# EAGLE design FUSE (EAGLE 9.4.0)
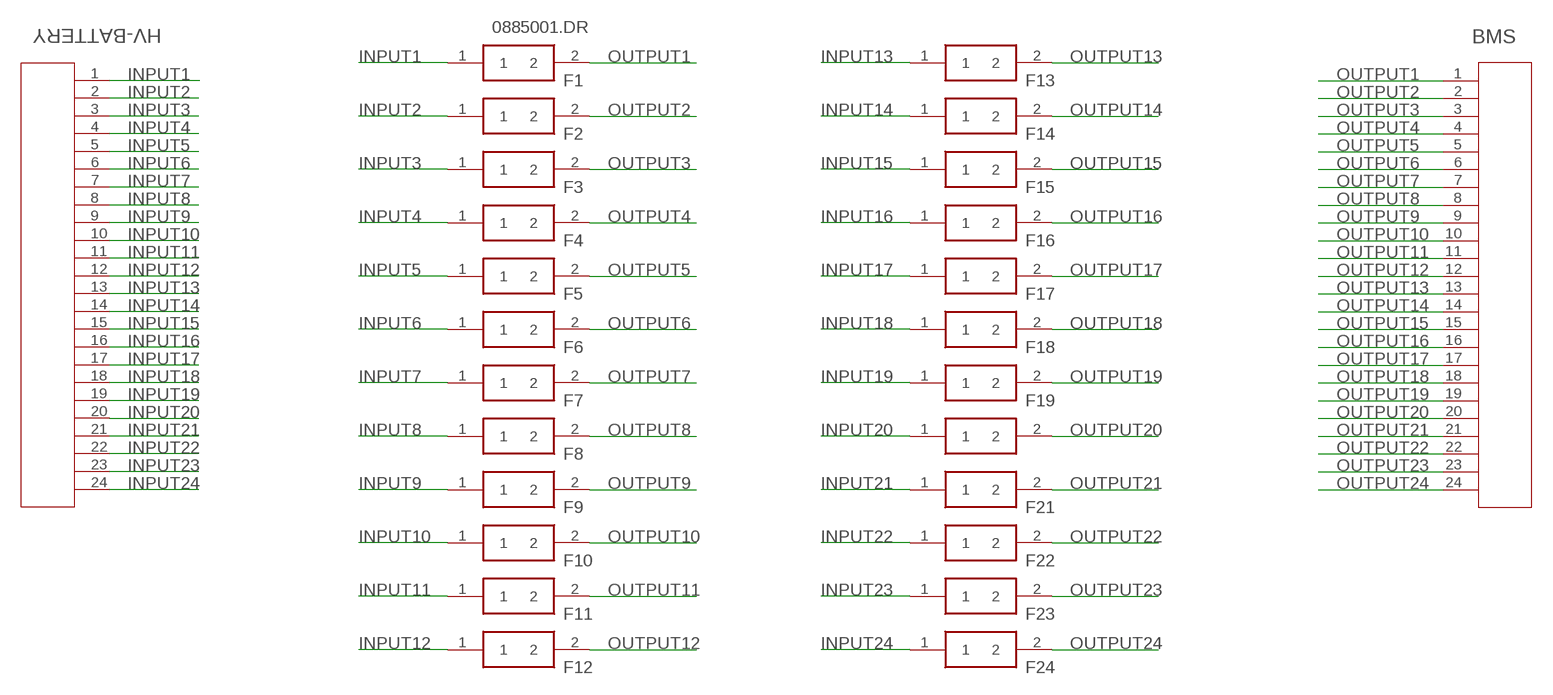
[diagram p0: schematic, sheet 1]

## Parts
BMS  24P(90DEG)_1-794108-0  [CON24_2X12_P4_14MM_RAMNL]
F1  0885001.DR  [FUSC10948X488N]
F2  0885001.DR  [FUSC10948X488N]
F3  0885001.DR  [FUSC10948X488N]
F4  0885001.DR  [FUSC10948X488N]
F5  0885001.DR  [FUSC10948X488N]
F6  0885001.DR  [FUSC10948X488N]
F7  0885001.DR  [FUSC10948X488N]
F8  0885001.DR  [FUSC10948X488N]
F9  0885001.DR  [FUSC10948X488N]
F10  0885001.DR  [FUSC10948X488N]
F11  0885001.DR  [FUSC10948X488N]
F12  0885001.DR  [FUSC10948X488N]
F13  0885001.DR  [FUSC10948X488N]
F14  0885001.DR  [FUSC10948X488N]
F15  0885001.DR  [FUSC10948X488N]
F16  0885001.DR  [FUSC10948X488N]
F17  0885001.DR  [FUSC10948X488N]
F18  0885001.DR  [FUSC10948X488N]
F19  0885001.DR  [FUSC10948X488N]
F20  0885001.DR  [FUSC10948X488N]
F21  0885001.DR  [FUSC10948X488N]
F22  0885001.DR  [FUSC10948X488N]
F23  0885001.DR  [FUSC10948X488N]
F24  0885001.DR  [FUSC10948X488N]
HV-BATTERY  24P(90DEG)_1-794108-0  [CON24_2X12_P4_14MM_RAMNL]

## Nets
INPUT1: F1.1 HV-BATTERY.1
INPUT2: F2.1 HV-BATTERY.2
INPUT3: F3.1 HV-BATTERY.3
INPUT4: F4.1 HV-BATTERY.4
INPUT5: F5.1 HV-BATTERY.5
INPUT6: F6.1 HV-BATTERY.6
INPUT7: F7.1 HV-BATTERY.7
INPUT8: F8.1 HV-BATTERY.8
INPUT9: F9.1 HV-BATTERY.9
INPUT10: F10.1 HV-BATTERY.10
INPUT11: F11.1 HV-BATTERY.11
INPUT12: F12.1 HV-BATTERY.12
INPUT13: F13.1 HV-BATTERY.13
INPUT14: F14.1 HV-BATTERY.14
INPUT15: F15.1 HV-BATTERY.15
INPUT16: F16.1 HV-BATTERY.16
INPUT17: F17.1 HV-BATTERY.17
INPUT18: F18.1 HV-BATTERY.18
INPUT19: F19.1 HV-BATTERY.19
INPUT20: F20.1 HV-BATTERY.20
INPUT21: F21.1 HV-BATTERY.21
INPUT22: F22.1 HV-BATTERY.22
INPUT23: F23.1 HV-BATTERY.23
INPUT24: F24.1 HV-BATTERY.24
OUTPUT1: BMS.1 F1.2
OUTPUT2: BMS.2 F2.2
OUTPUT3: BMS.3 F3.2
OUTPUT4: BMS.4 F4.2
OUTPUT5: BMS.5 F5.2
OUTPUT6: BMS.6 F6.2
OUTPUT7: BMS.7 F7.2
OUTPUT8: BMS.8 F8.2
OUTPUT9: BMS.9 F9.2
OUTPUT10: BMS.10 F10.2
OUTPUT11: BMS.11 F11.2
OUTPUT12: BMS.12 F12.2
OUTPUT13: BMS.13 F13.2
OUTPUT14: BMS.14 F14.2
OUTPUT15: BMS.15 F15.2
OUTPUT16: BMS.16 F16.2
OUTPUT17: BMS.17 F17.2
OUTPUT18: BMS.18 F18.2
OUTPUT19: BMS.19 F19.2
OUTPUT20: BMS.20 F20.2
OUTPUT21: BMS.21 F21.2
OUTPUT22: BMS.22 F22.2
OUTPUT23: BMS.23 F23.2
OUTPUT24: BMS.24 F24.2

## Library data of the parts
BMS HV-BATTERY = con-MATE-N-LOK:24P(90DEG)_1-794108-0; MANUFACTURER_PART_NUMBER: 17941080; VENDOR: TE Connectivity
F1-F24 = 0885001.DR:0885001.DR: LITTELFUSE - 0885001.DR - FUSE, AEC-Q200, 1A, 500VDC, 0402 Source: Datasheet <https://m.littelfuse.com/~/media/electronics/datasheets/fuses/littelfuse_fuse_885_datasheet.pdf.pdf>; DESCRIPTION: LITTELFUSE - 0885001.DR - FUSE, AEC-Q200, 1A, 500VDC, 0402; HEIGHT: 4.88mm; MANUFACTURER_NAME: LITTELFUSE; MANUFACTURER_PART_NUMBER: 0885001.DR; MOUSER_PART_NUMBER: 576-0885001.DR; MOUSER_PRICE-STOCK: https://www.mouser.com/Search/Refine.aspx?Keyword=576-0885001.DR

## Board
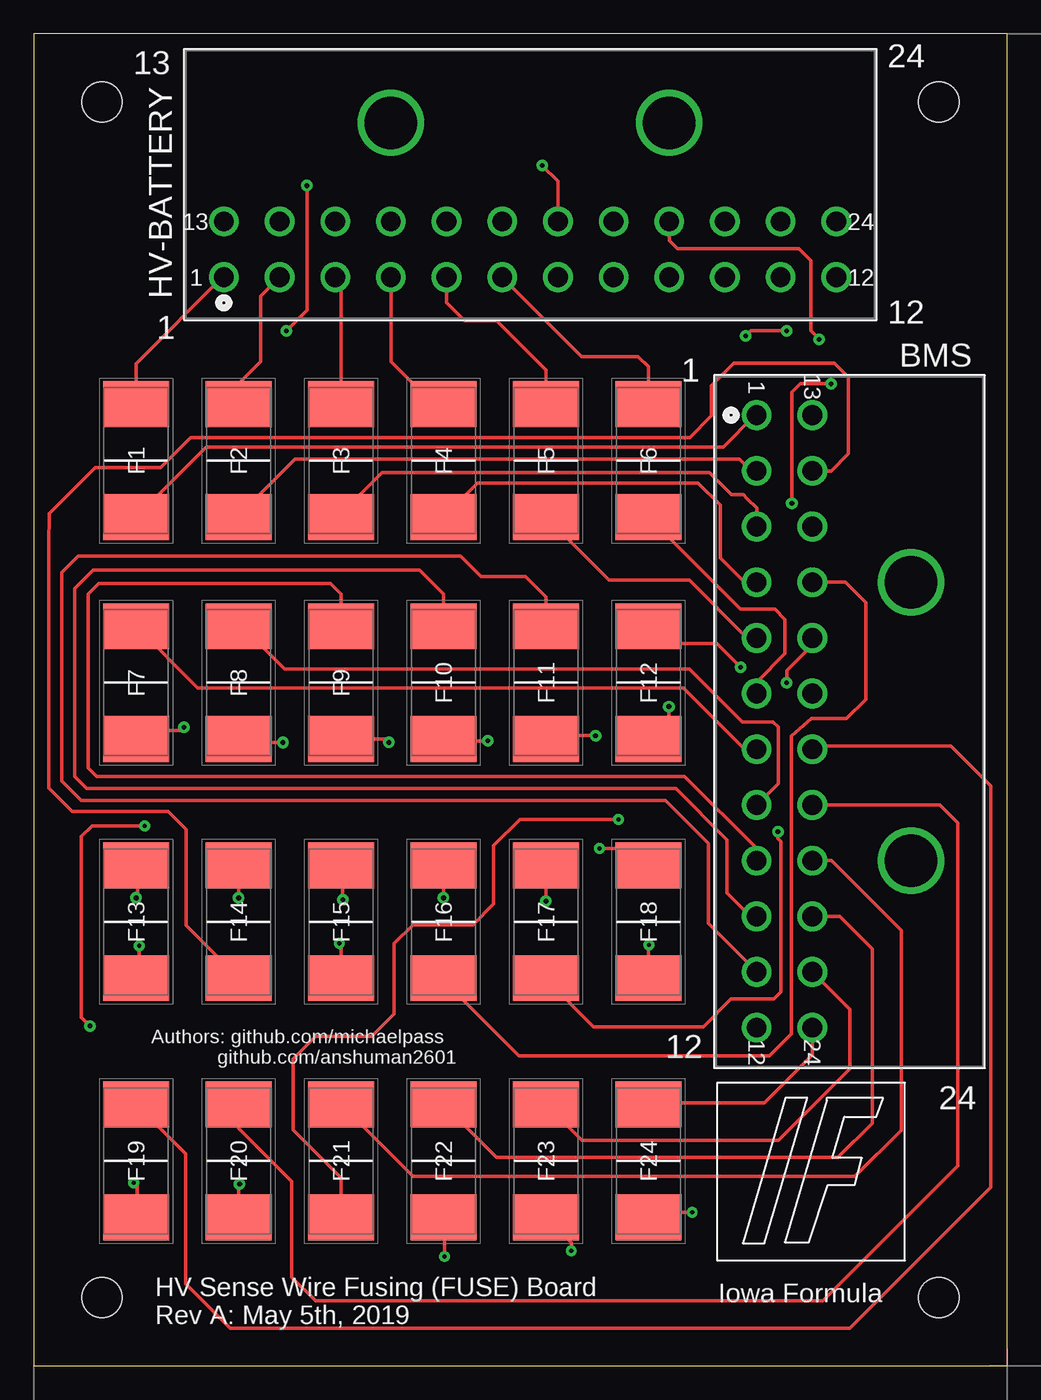
[diagram p1: board, top side]
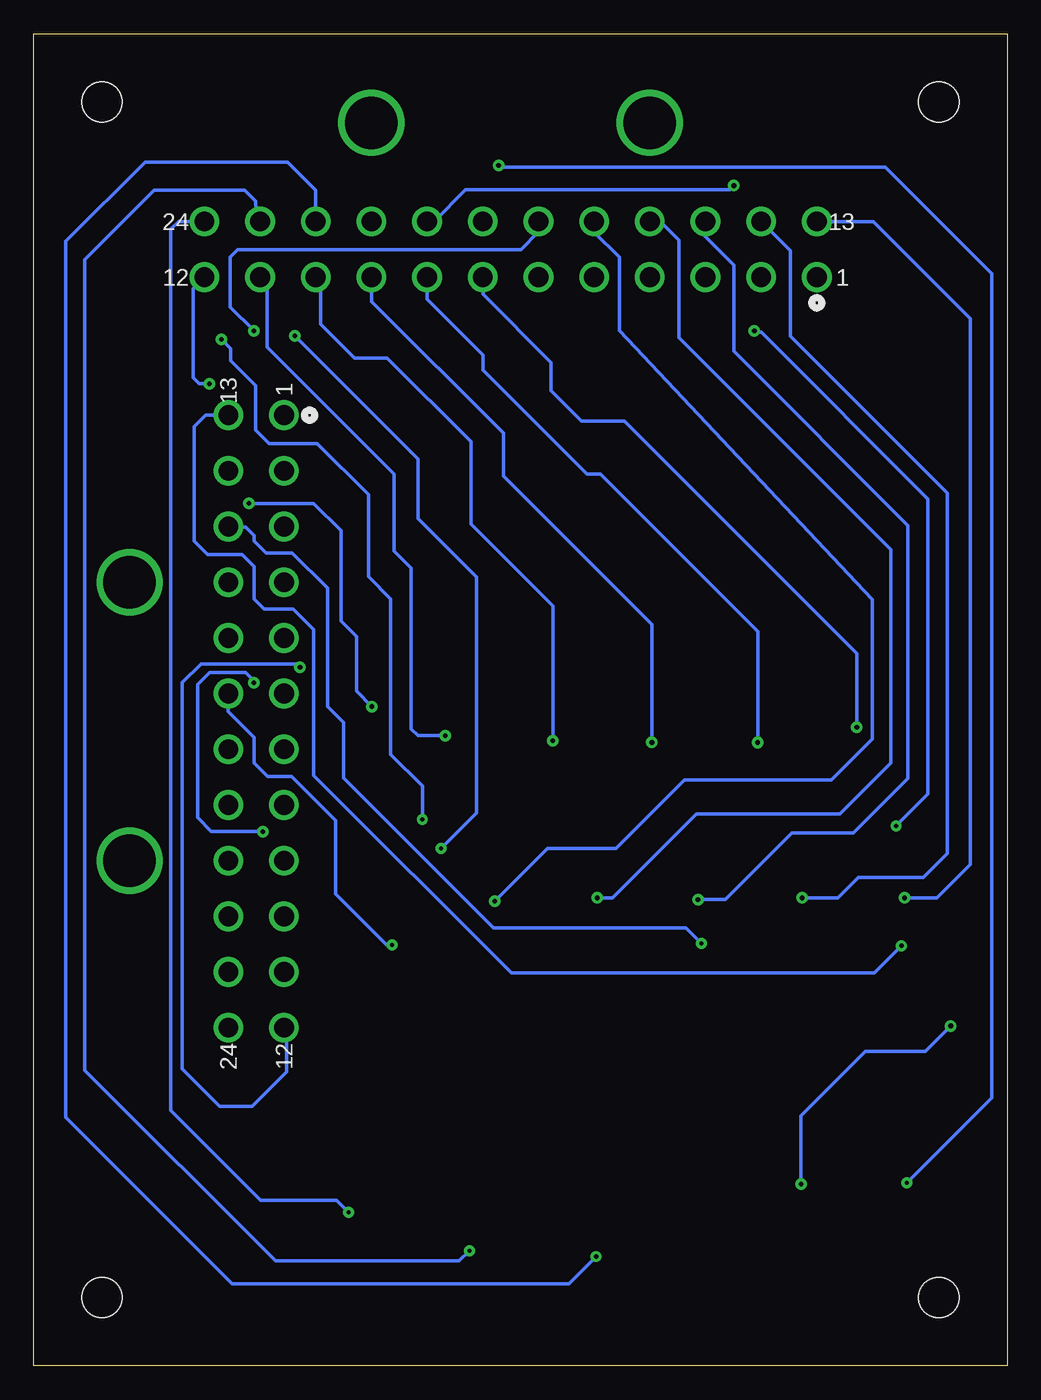
[diagram p2: board, bottom side, seen from below]

Size 72.39 x 99.06 mm. Coordinates in mm from the lower left corner, seen from the top.
Outline: 0,0 72.39,0 72.39,99.06 0,99.06 0,0
Copper layers (1*16): Top 0.035mm / dielectric 1.5mm / Bottom 0.035mm
Design rules "default *": minimum track width 8mil, minimum drill 12mil, track to track 8mil, track to pad 8mil, pad to pad 8mil, via to via 8mil, smd to smd 8mil, copper to edge 10mil, drill to drill 8mil, minimum pad ring 12mil, minimum via ring 10mil, stop-mask expansion 4mil, vias tented up to drill 35mil, thermal gap 10mil
Holes 3 mm at 5.08,5.08 67.31,5.08 67.31,93.98 5.08,93.98

### Footprints (pad centres in the part's own frame; a part is rotated, then mirrored left to right if it is on the bottom)
CON24_2X12_P4_14MM_RAMNL = drill 1.473 pad 1.981: 1 -45.542,-4.14; 2 -41.402,-4.14; 3 -37.262,-4.14; 4 -33.122,-4.14; 5 -28.981,-4.14; 6 -24.841,-4.14; 7 -20.701,-4.14; 8 -16.561,-4.14; 9 -12.421,-4.14; 10 -8.28,-4.14; 11 -4.14,-4.14; 12 0,-4.14; 13 -45.542,0; 14 -41.402,0; 15 -37.262,0; 16 -33.122,0; 17 -28.981,0; 18 -24.841,0; 19 -20.701,0; 20 -16.561,0; 21 -12.421,0; 22 -8.28,0; 23 -4.14,0; 24 0,0 | drill 3.912 pad 3.912: 25 -33.122,7.341; 26 -12.421,7.341
FUSC10948X488N = smd 3.41 x 4.91: 1 -4.195,0; 2 4.195,0

### Placement (x,y rotation side)
BMS  57.91,25.15 270 top
F1  7.62,67.31 270 top
F2  15.24,67.31 270 top
F3  22.86,67.31 270 top
F4  30.48,67.31 270 top
F5  38.1,67.31 270 top
F6  45.72,67.31 270 top
F7  7.62,50.8 90 top
F8  15.24,50.8 90 top
F9  22.86,50.8 90 top
F10  30.48,50.8 90 top
F11  38.1,50.8 90 top
F12  45.72,50.8 90 top
F13  7.62,33.02 270 top
F14  15.24,33.02 270 top
F15  22.86,33.02 270 top
F16  30.48,33.02 270 top
F17  38.1,33.02 270 top
F18  45.72,33.02 270 top
F19  7.62,15.24 90 top
F20  15.24,15.24 90 top
F21  22.86,15.24 90 top
F22  30.48,15.24 90 top
F23  38.1,15.24 90 top
F24  45.72,15.24 90 top
HV-BATTERY  59.69,85.09 0 top

### Tracks (layer width: path | path; a pad name or v marks a point on that pad's centre or on a via)
INPUT1
  Top 0.254: HV-BATTERY.1 14.15,81.05 7.62,74.52 F1.1
INPUT2
  Top 0.254: HV-BATTERY.2 16.89,79.55 16.89,74.68 15.24,73.03 F2.1
INPUT3
  Top 0.254: F3.1 22.86,80.43 22.38,80.9 HV-BATTERY.3
INPUT4
  Top 0.254: HV-BATTERY.4 26.57,74.66 29.72,71.5 F4.1
INPUT5
  Top 0.254: HV-BATTERY.5 30.71,79.05 32.03,77.72 34.42,77.72 38.1,74.05 F5.1
INPUT6
  Top 0.254: HV-BATTERY.6 40.74,75.06 44.96,75.06 45.72,74.3 F6.1
INPUT7  (via drill 0.35)
  Top 0.254: v11.18,47.49 10.92,47.24 8.26,47.24 F7.1
  Bottom 0.254: HV-BATTERY.7 38.99,79.68 33.91,74.6 33.91,72.5 31.64,70.23 28.45,70.23 11.18,52.95 v11.18,47.49
INPUT8  (via drill 0.35)
  Top 0.254: F8.1 14.99,46.35 v18.54,46.35
  Bottom 0.254: HV-BATTERY.8 43.13,79.3 38.99,75.16 38.99,74.04 31.25,66.29 30.23,66.29 18.54,54.61 v18.54,46.35
INPUT9  (via drill 0.35)
  Top 0.254: v26.42,46.35 26.17,46.6 F9.1
  Bottom 0.254: HV-BATTERY.9 47.27,79.15 37.47,69.34 37.47,66.17 26.42,55.12 v26.42,46.35
INPUT10  (via drill 0.35)
  Top 0.254: v33.78,46.48 30.6,46.48 F10.1
  Bottom 0.254: HV-BATTERY.10 51.05,80.59 51.05,77.47 48.51,74.93 46.1,74.93 39.88,68.71 39.88,66.21 39.88,66.04 39.88,62.61 33.78,56.52 v33.78,46.48
INPUT11  (via drill 0.35)
  Top 0.254: v41.78,46.86 38.36,46.86 F11.1
  Bottom 0.254: HV-BATTERY.11 55.04,80.44 55.04,75.74 45.59,66.29 45.59,60.58 44.32,59.31 44.32,47.37 43.81,46.86 v41.78,46.86
INPUT12  (via drill 0.35)
  Top 0.254: v47.24,49.02 47.24,48.13 F12.1 | v56.39,64.14 56.39,72.39 57.02,73.03 v59.31,73.03
  Bottom 0.254: HV-BATTERY.12 60.54,80.1 60.54,73.5 60.07,73.03 v59.31,73.03 | v47.24,49.02 48.39,50.16 48.39,54.23 49.53,55.37 49.53,62.1 51.56,64.14 v56.39,64.14
INPUT13  (via drill 0.35)
  Top 0.254: v7.62,34.8 7.75,34.93 7.75,37.09 F13.1
  Bottom 0.254: HV-BATTERY.13 9.96,85.09 2.74,77.88 2.74,37.27 5.21,34.8 v7.62,34.8
INPUT14  (via drill 0.35)
  Top 0.254: F14.1 v15.24,34.8
  Bottom 0.254: HV-BATTERY.14 16.13,82.93 16.13,76.58 4.45,64.9 4.45,38.1 6.22,36.32 11.05,36.32 12.57,34.8 v15.24,34.8
INPUT15  (via drill 0.35)
  Top 0.254: F15.1 22.99,37.09 v22.99,34.67
  Bottom 0.254: HV-BATTERY.15 22.43,83.95 20.32,81.84 20.32,75.44 7.37,62.48 7.37,43.69 11.43,39.62 16,39.62 20.95,34.67 v22.99,34.67
INPUT16  (via drill 0.35)
  Top 0.254: v30.48,34.8 F16.1
  Bottom 0.254: v30.48,34.8 29.34,34.8 23.11,41.02 12.45,41.02 8.64,44.83 8.64,60.71 24.38,76.45 24.38,83.69 25.78,85.09 HV-BATTERY.16
INPUT17  (via drill 0.35)
  Top 0.254: v38.1,34.54 F17.1
  Bottom 0.254: v38.1,34.54 34.16,38.48 29.08,38.48 24,43.56 13.08,43.56 10.03,46.61 10.03,56.98 28.83,76.96 28.83,82.42 30.71,84.3 HV-BATTERY.17
INPUT18  (via drill 0.3, 0.35)
  Top 0.254: F18.1 45.01,37.22 43.74,38.48 v42.09,38.48 | v56.01,76.96 53.34,76.96 v52.96,76.58
  Bottom 0.254: HV-BATTERY.18 34.85,84.32 36.16,83.01 57.2,83.01 57.78,82.42 57.78,78.74 v56.01,76.96 | v52.96,76.58 43.81,67.44 43.81,62.99 39.47,58.65 39.47,41.1 v42.09,38.48
INPUT19  (via drill 0.3, 0.35)
  Top 0.254: v7.44,13.61 7.7,13.36 7.7,11.12 F19.1 | HV-BATTERY.19 38.99,88.08 v37.81,89.26
  Bottom 0.254: v37.81,89.26 37.69,89.13 9.06,89.13 1.14,81.2 1.14,19.92 v7.44,13.61
INPUT20  (via drill 0.3, 0.35)
  Top 0.254: v8.26,40.16 4.34,40.16 3.56,39.37 3.56,25.91 v4.19,25.27 | v15.32,13.51 15.24,13.44 F20.1 | v20.32,87.76 20.32,78.49 v18.8,76.96
  Bottom 0.254: HV-BATTERY.20 42.62,85.09 40.26,87.45 20.62,87.45 v20.32,87.76 | v8.26,40.16 5.89,42.52 5.89,64.47 18.27,76.85 18.68,76.85 v18.8,76.96 | v15.32,13.51 15.32,18.59 10.54,23.37 6.1,23.37 v4.19,25.27
INPUT21  (via drill 0.3, 0.35)
  Top 0.254: v43.48,40.64 36.17,40.64 34.21,38.68 34.21,34.34 32.66,32.79 28.22,32.79 26.82,31.39 26.82,26.19 25.15,24.51 20.95,24.51 19.28,22.84 19.28,17.55 22.86,13.97 F21.1 | v58.42,76.33 57.78,76.96 57.78,82.17 56.9,83.06 47.88,83.06 47.27,83.67 HV-BATTERY.21
  Bottom 0.254: v43.48,40.64 43.48,43.1 45.85,45.47 45.85,57.02 47.5,58.67 47.5,64.77 51.31,68.58 54.86,68.58 55.88,69.6 55.88,72.9 57.73,74.75 57.73,75.64 v58.42,76.33
INPUT22  (via drill 0.3)
  Top 0.254: v30.56,8.13 30.56,10.97 F22.1
  Bottom 0.254: v30.56,8.13 32.59,6.1 57.63,6.1 70,18.47 70,83.62 64.11,89.51 53.49,89.51 51.41,87.43 HV-BATTERY.22
INPUT23  (via drill 0.3)
  Top 0.254: v39.98,8.56 39.98,9.16 F23.1
  Bottom 0.254: v39.98,8.56 40.74,7.8 54.41,7.8 68.58,21.97 68.58,82.27 63.42,87.43 56.69,87.43 55.88,86.61 55.8,85.14 55.68,85.14 HV-BATTERY.23
INPUT24  (via drill 0.3)
  Top 0.254: v48.97,11.4 45.95,11.4 45.72,11.18 F24.1
  Bottom 0.254: HV-BATTERY.24 61.62,85.09 62.2,84.51 62.2,19 55.5,12.29 49.86,12.29 v48.97,11.4
OUTPUT1
  Top 0.254: F1.2 12.83,68.33 51.28,68.33 53.65,70.69 BMS.1
OUTPUT2
  Top 0.254: F2.2 15.24,63.24 19.43,67.44 52.5,67.44 53.39,66.55 BMS.2
OUTPUT3
  Top 0.254: F3.2 22.86,63.37 25.91,66.42 50.24,66.42 51.89,64.77 52.78,64.77 53.06,64.49 53.77,63.78 BMS.3
OUTPUT4
  Top 0.254: F4.2 33.02,65.66 49.4,65.66 51.05,64.01 51.05,60.07 52.86,58.27 BMS.4
OUTPUT5
  Top 0.254: F5.2 42.8,58.42 48.77,58.42 53.06,54.13 BMS.5
OUTPUT6
  Top 0.254: F6.2 52.57,56.26 55.12,56.26 55.88,55.5 55.88,52.96 53.77,50.85 BMS.6
OUTPUT7
  Top 0.254: F7.2 12.2,50.42 48.31,50.42 52.88,45.85 BMS.7
OUTPUT8
  Top 0.254: F8.2 15.49,54.99 18.67,51.82 48.77,51.82 52.7,47.88 54.99,47.88 55.37,47.5 55.37,43.31 BMS.8
OUTPUT9
  Top 0.254: F9.2 22.86,57.41 22.1,58.17 4.83,58.17 4.06,57.4 4.06,44.45 4.7,43.81 48.41,43.81 53.77,38.46 BMS.9
OUTPUT10
  Top 0.254: F10.2 30.48,57.41 28.71,59.18 4.45,59.18 3.05,57.78 3.05,43.81 3.94,42.93 47.75,42.93 51.56,39.12 51.56,35.18 53.31,33.43 BMS.10
OUTPUT11
  Top 0.254: F11.2 38.1,57.15 36.58,58.67 33.27,58.67 31.75,60.2 3.3,60.2 2.11,59 2.11,43.48 3.56,42.04 46.99,42.04 50.16,38.86 50.16,32.89 BMS.11
OUTPUT12  (via drill 0.35)
  Top 0.254: F12.2 46.99,53.72 50.8,53.72 v52.58,51.94
  Bottom 0.254: v52.58,51.94 52.83,52.2 59.94,52.2 61.34,50.8 61.34,22.1 58.55,19.3 56.13,19.3 53.59,21.84 53.59,24.97 BMS.12
OUTPUT13  (via drill 0.3)
  Top 0.254: v7.85,31.24 7.85,28.98 7.72,28.85 F13.2
  Bottom 0.254: BMS.13 59.59,70.69 60.45,69.83 60.45,61.34 59.44,60.33 56.9,60.33 56.01,59.44 56.01,57.02 55.24,56.26 53.09,56.26 51.56,54.74 51.56,43.92 36.85,29.21 9.88,29.21 v7.85,31.24
OUTPUT14
  Top 0.254: F14.2 15.24,28.85 11.35,32.74 11.35,39.88 10.01,41.22 2.87,41.22 1.12,42.98 1.12,61.27 1.14,63.12 1.14,63.37 4.57,66.8 9.45,66.8 11.68,69.04 48.79,69.04 50.42,70.66 50.42,72.9 52.07,74.55 59.56,74.55 60.58,73.53 60.58,67.82 59.31,66.55 BMS.14
OUTPUT15  (via drill 0.3)
  Top 0.254: v22.73,31.42 22.86,31.29 F15.2
  Bottom 0.254: v22.73,31.42 23.88,32.56 38.2,32.56 49.35,43.71 49.35,47.83 50.55,49.02 50.55,57.83 53.16,60.45 55.12,60.45 56.01,61.34 56.01,61.75 56.64,62.38 57.91,62.38 BMS.15
OUTPUT16
  Top 0.254: BMS.16 60.38,58.27 61.87,56.77 61.87,49.55 60.45,48.13 57.85,48.13 56.36,46.84 56.36,24.69 54.71,23.04 36.09,23.04 30.48,28.65 F16.2
OUTPUT17  (via drill 0.35)
  Top 0.254: BMS.17 57.91,53.59 56.01,51.69 v56.01,50.8 | F17.2 38.2,28.65 41.63,25.22 49.81,25.22 51.87,27.28 55.04,27.28 55.58,27.81 55.58,38.98 55.35,39.2 v55.35,39.71
  Bottom 0.254: v56.01,50.8 56.01,50.93 56.64,51.56 59.31,51.56 60.2,50.67 60.2,40.77 59.18,39.75 55.39,39.75 v55.35,39.71
OUTPUT18  (via drill 0.3)
  Top 0.254: v45.74,31.29 45.72,31.27 F18.2
  Bottom 0.254: BMS.18 57.91,48.64 56.01,46.74 56.01,44.83 54.99,43.81 53.21,43.81 49.94,40.54 49.94,35.1 46.13,31.29 v45.74,31.29
OUTPUT19
  Top 0.254: F19.2 11.3,15.75 11.3,6.1 14.61,2.79 60.71,2.79 71.17,13.26 71.17,43.13 68.2,46.1 58.17,46.1 BMS.19
OUTPUT20
  Top 0.254: F20.2 15.24,17.66 19.18,13.72 19.18,6.6 20.95,4.83 58.67,4.83 68.71,14.86 68.71,40.39 67.39,41.71 BMS.20
OUTPUT21
  Top 0.254: F21.2 28.2,14.1 61.09,14.1 64.52,17.53 64.52,32.38 59.33,37.57 BMS.21
OUTPUT22
  Top 0.254: F22.2 34.42,15.49 59.82,15.49 62.36,18.03 62.36,30.99 59.94,33.4 57.94,33.4 BMS.22
OUTPUT23
  Top 0.254: F23.2 40.77,16.76 55.37,16.76 60.71,22.1 60.71,26.49 BMS.23
OUTPUT24
  Top 0.254: F24.2 45.84,19.56 54.36,19.56 57.91,23.11 BMS.24

### Text on the board
tNames: 13 | 24 | 12 | 1 | 1 | 12 | Authors: github.com/michaelpass / github.com/anshuman2601 | 24 | Iowa Formula | HV Sense Wire Fusing (FUSE) Board / Rev A: May 5th, 2019